# EasyEDA schematic led_boards_easyEDA.json
TITLE: Sheet_1; REV: 1.0; Date: 2022-04-05; Sheet: 1/1; Drawn By: o0morgan0o; Company: Your Company
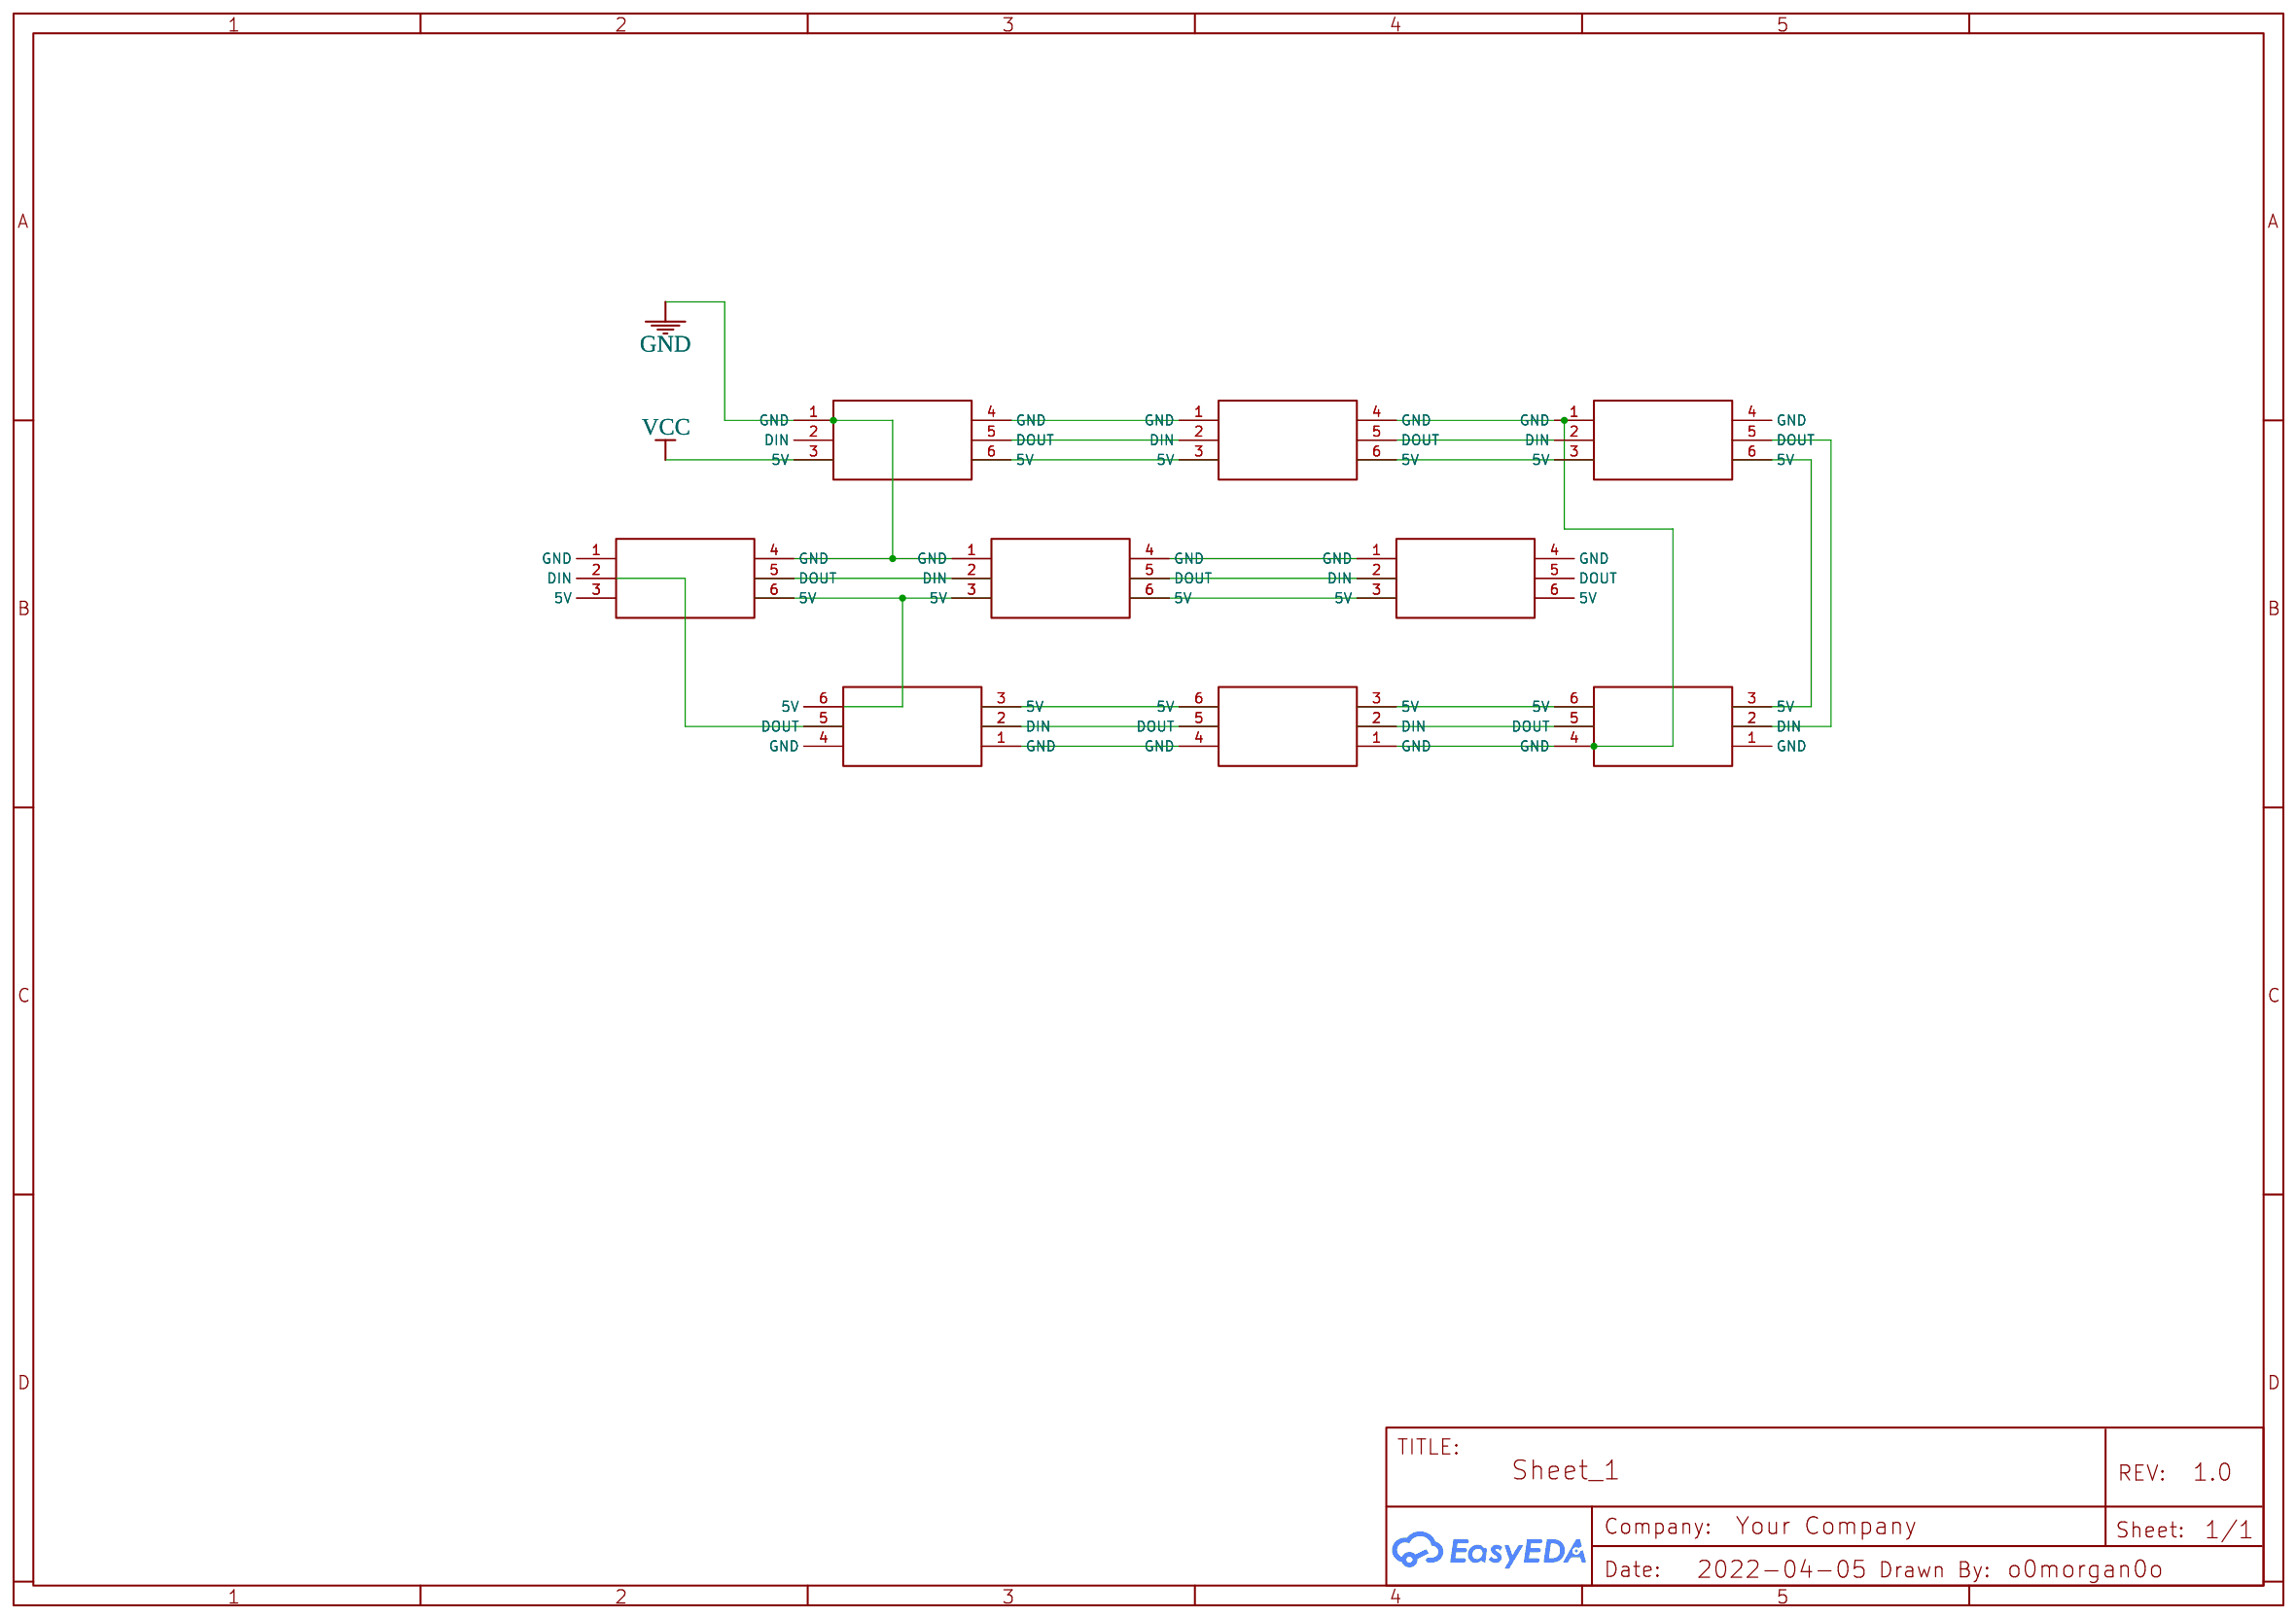
[diagram p0: schematic sheet]

## Parts
U1  LED condensed strip single  [NEOPIXEL STRIP FOOTPRINT CUSTOM]
U2  LED condensed strip single  [NEOPIXEL STRIP FOOTPRINT CUSTOM]
U3  LED condensed strip single  [NEOPIXEL STRIP FOOTPRINT CUSTOM]
U4  LED condensed strip single  [NEOPIXEL STRIP FOOTPRINT CUSTOM]
U5  LED condensed strip single  [NEOPIXEL STRIP FOOTPRINT CUSTOM]
U6  LED condensed strip single  [NEOPIXEL STRIP FOOTPRINT CUSTOM]
U7  LED condensed strip single  [NEOPIXEL STRIP FOOTPRINT CUSTOM]
U8  LED condensed strip single  [NEOPIXEL STRIP FOOTPRINT CUSTOM]
U9  LED condensed strip single  [NEOPIXEL STRIP FOOTPRINT CUSTOM]

## Library data of the parts
U1-U9 = LED condensed strip single: Contributor: o0morgan0o

## Nets
GND: U1.1(GND) U2.4(GND) U3.1(GND)
VCC: U1.3(5V)
Net-(U1-4): U1.4(GND) U4.1(GND)
Net-(U1-5): U1.5(DOUT) U4.2(DIN)
Net-(U1-6): U1.6(5V) U4.3(5V)
Net-(U2-2): U2.2(DIN) U7.5(DOUT)
Net-(U2-5): U2.5(DOUT) U3.2(DIN)
Net-(U2-6): U2.6(5V) U3.3(5V) U7.6(5V)
Net-(U3-4): U3.4(GND) U5.1(GND)
Net-(U3-5): U3.5(DOUT) U5.2(DIN)
Net-(U3-6): U3.6(5V) U5.3(5V)
Net-(U4-4): U4.4(GND) U6.1(GND) U8.1(GND) U9.4(GND)
Net-(U4-5): U4.5(DOUT) U6.2(DIN)
Net-(U4-6): U4.6(5V) U6.3(5V)
Net-(U6-5): U6.5(DOUT) U9.2(DIN)
Net-(U6-6): U6.6(5V) U9.3(5V)
Net-(U7-1): U7.1(GND) U8.4(GND)
Net-(U7-2): U7.2(DIN) U8.5(DOUT)
Net-(U7-3): U7.3(5V) U8.6(5V)
Net-(U8-2): U8.2(DIN) U9.5(DOUT)
Net-(U8-3): U8.3(5V) U9.6(5V)

Not connected (* = marked no-connect by the designer): U1 2(DIN); U2 1(GND) 3(5V); U5 4(GND) 5(DOUT) 6(5V); U6 4(GND); U7 4(GND); U9 1(GND)
